# Altium project Solar_Sense_Node.PrjPcb
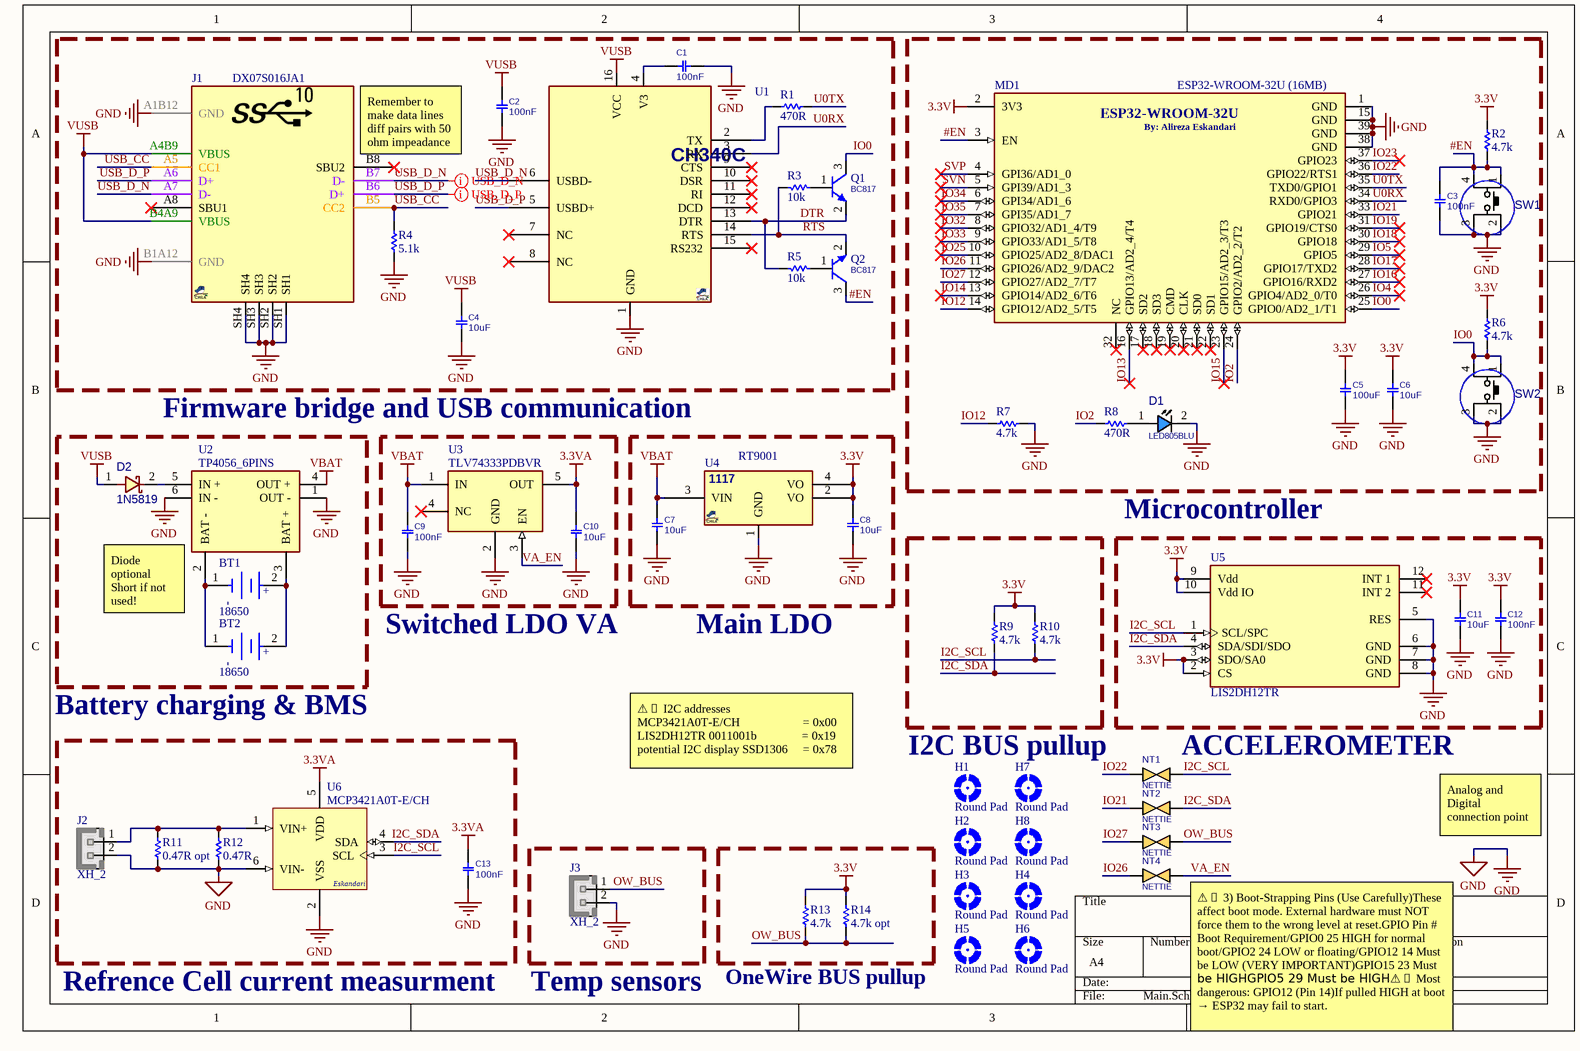
[diagram p0: Main.SchDoc]
1 sheet, 57 parts. Net scope: global (net labels, ports and power ports of the same name join across sheets).
Board file: PCB1.PcbDoc

## Sheet Main.SchDoc: Solar Sesne Node
size A4; CompanyName: University of Tehran; DrawnBy: Alireza Eskandari; SheetNumber: 1; SheetTotal: 1

### Parts
BT1  18650  [FP-1042P-MFG]
BT2  18650  [FP-1042P-MFG]
C1  100nF  [C0805]
C2  100nF  [C0805]
C3  100nF  [C0805]
C4  10uF  [C0805]
C5  100uF  [C0805]
C6  10uF  [C0805]
C7  10uF  [C0805]
C8  10uF  [C0805]
C9  100nF  [C0805]
C10  10uF  [C0805]
C11  10uF  [C0805]
C12  100nF  [C0805]
C13  100nF  [C0805]
D1  LED805BLU  [LED0805BLU]
D2  1N5819  [D_SOD123W]
H1  Round Pad  [P3.0C]  (no BOM)
H2  Round Pad  [P3.0C]  (no BOM)
H3  Round Pad  [P3.0C]  (no BOM)
H4  Round Pad  [P3.0C]  (no BOM)
H5  Round Pad  [P3.0C]  (no BOM)
H6  Round Pad  [P3.0C]  (no BOM)
H7  Round Pad  [P3.0C]  (no BOM)
H8  Round Pad  [P3.0C]  (no BOM)
J1  DX07S016JA1  [USBC_SMD_16_DX07S016JA1]
J2  XH_2  [XH_2]
J3  XH_2  [XH_2]
MD1  ESP32-WROOM-32U (16MB)  [FP-ESP32-WROOM-32U_16MB-MFG]
NT1  NETTIE  [NETTIE_40X50]  (net tie, no BOM)
NT2  NETTIE  [NETTIE_40X50]  (net tie, no BOM)
NT3  NETTIE  [NETTIE_40X50]  (net tie, no BOM)
NT4  NETTIE  [NETTIE_40X50]  (net tie, no BOM)
Q1  BC817  [SOT23_3]
Q2  BC817  [SOT23_3]
R1  470R  [RES0805]
R2  4.7k  [RES0805]
R3  10k  [RES0805]
R4  5.1k  [RES0805]
R5  10k  [RES0805]
R6  4.7k  [RES0805]
R7  4.7k  [RES0805]
R8  470R  [RES0805]
R9  4.7k  [RES0805]
R10  4.7k  [RES0805]
R11  0.47R opt  [RES0805]
R12  0.47R  [RES0805]
R13  4.7k  [RES0805]
R14  4.7k opt  [RES0805]
SW1  PUSHBUTTON  [SWPBS_SPDT_5X5X1]  (value not drawn)
SW2  PUSHBUTTON  [SWPBS_SPDT_5X5X1]  (value not drawn)
U1  CH340C  [SO_16]  (value not drawn)
U2  TP4056_6PINS  [TP4056_6PINs]
U3  TLV74333PDBVR  [FP-DBV0005A-MFG]
U4  RT9001  [SOT223_4]
U5  LIS2DH12TR  [FP-LGA-12-8365767-MFG]
U6  MCP3421A0T-E/CH  [SOT-23-CH6_L]

### Blocks framed on the sheet
Firmware bridge and USB communication: C1 C2 C4 J1 Q1 Q2 R1 R3-R5 U1
Microcontroller: C3 C5 C6 D1 MD1 R2 R6-R8 SW1 SW2
Battery charging & BMS: BT1 BT2 D2 U2
Switched LDO VA: C9 C10 U3
Main LDO: C7 C8 U4
I2C BUS pullup: R9 R10
ACCELEROMETER: C11 C12 U5
Refrence Cell current measurment: C13 J2 R11 R12 U6
Temp sensors: J3
OneWire BUS pullup: R13 R14

### Nets
3.3V: C5.2 C6.2 C8.2 C11.2 C12.1 MD1.2(3V3) R2.2 R6.2 R9.2 R10.2 R13.2 R14.2 U4.2(VO) U4.4(VO) U5.2(CS) U5.3(SDO/SA0) U5.9(Vdd) U5.10(Vdd_IO)
3.3VA: C10.2 C13.2 U3.5(OUT) U6.5(VDD)
GND: C1.1 C2.1 C3.1 C4.1 C5.1 C6.1 C7.1 C8.1 C9.1 C10.1 C11.1 C12.2 C13.1 D1.2(CATHODE) J1.A1B12(GND) J1.B1A12(GND) J1.SH1 J1.SH2 J1.SH3 J1.SH4 J2.2 J3.2 MD1.1(GND) MD1.15(GND) MD1.38(GND) MD1.39(GND) R4.1 R7.1 R11.1 R12.1 SW1.2(P3) SW1.3(P4) SW2.2(P3) SW2.3(P4) U1.1(GND) U2.1(OUT_-) U2.6(IN_-) U3.2(GND) U4.1(GND) U5.5(RES) U5.6(GND) U5.7(GND) U5.8(GND) U6.2(VSS) U6.6(VIN-)
SHIELD: H1.P H2.P H3.P H4.P H5.P H6.P H7.P H8.P
VBAT: C7.2 C9.2 U2.4(OUT_+) U3.1(IN) U4.3(VIN)
VUSB: C2.2 C4.2 D2.1 J1.A4B9(VBUS) J1.B4A9(VBUS) U1.16(VCC)
#EN: C3.2 MD1.3(EN) Q2.3(C) R2.1 SW1.1(P1) SW1.4(P2)
DTR: Q1.2(E) R5.2 U1.13(DTR)
I2C_SCL: NT1.2 R10.1 U5.1(SCL/SPC) U6.3(SCL)
I2C_SDA: NT2.2 R9.1 U5.4(SDA/SDI/SDO) U6.4(SDA)
IO0: MD1.25(GPIO0/AD2_1/T1) Q1.3(C) R6.1 SW2.1(P1) SW2.4(P2)
IO2: MD1.24(GPIO2/AD2_2/T2) R8.2
IO4: MD1.26(GPIO4/AD2_0/T0)
IO5: MD1.29(GPIO5)
IO12: MD1.14(GPIO12/AD2_5/T5) R7.2
IO13: MD1.16(GPIO13/AD2_4/T4)
IO14: MD1.13(GPIO14/AD2_6/T6)
IO15: MD1.23(GPIO15/AD2_3/T3)
IO16: MD1.27(GPIO16/RXD2)
IO17: MD1.28(GPIO17/TXD2)
IO18: MD1.30(GPIO18)
IO19: MD1.31(GPIO19/CTS0)
IO21: MD1.33(GPIO21) NT2.1
IO22: MD1.36(GPIO22/RTS1) NT1.1
IO23: MD1.37(GPIO23)
IO25: MD1.10(GPIO25/AD2_8/DAC1)
IO26: MD1.11(GPIO26/AD2_9/DAC2) NT4.1
IO27: MD1.12(GPIO27/AD2_7/T7) NT3.1
IO32: MD1.8(GPIO32/AD1_4/T9)
IO33: MD1.9(GPIO33/AD1_5/T8)
IO34: MD1.6(GPI34/AD1_6)
IO35: MD1.7(GPI35/AD1_7)
OW_BUS: J3.1 NT3.2 R13.1 R14.1
RTS: Q2.2(E) R3.2 U1.14(RTS)
SVN: MD1.5(GPI39/AD1_3)
SVP: MD1.4(GPI36/AD1_0)
U0RX: MD1.34(RXD0/GPIO3) U1.3(RX)
U0TX: MD1.35(TXD0/GPIO1) R1.1
USB_CC: J1.A5(CC1) J1.B5(CC2) R4.2
USB_D_N: J1.A7(D-) J1.B7(D-) U1.6(USBD-)
USB_D_P: J1.A6(D+) J1.B6(D+) U1.5(USBD+)
VA_EN: NT4.2 U3.3(EN)
NetBT1_1: BT1.1(C) BT2.1(C) U2.2(BAT_-)
NetBT1_2: BT1.2(A) BT2.2(A) U2.3(BAT_+)
NetC1_2: C1.2 U1.4(V3)
NetD1_1: D1.1(ANODE) R8.1
NetD2_2: D2.2 U2.5(IN_+)
NetJ2_1: J2.1 R11.2 R12.2 U6.1(VIN+)
NetQ1_1: Q1.1(B) R3.1
NetQ2_1: Q2.1(B) R5.1
NetR1_2: R1.2 U1.2(TX)

Not connected (* = marked no-connect by the designer): J1 A8(SBU1)* B8(SBU2)*; MD1 17(SD2)* 18(SD3)* 19(CMD)* 20(CLK)* 21(SD0)* 22(SD1)* 32(NC)*; U1 7(NC)* 8(NC)* 9(CTS)* 10(DSR)* 11(RI)* 12(DCD)* 15(RS232)*; U3 4(NC)*; U5 11(INT_2)* 12(INT_1)*

### Layout directives
differential pair: USB_D_N, USB_D_P

### Notes on the sheet
- (near J1) Remember to make data lines diff pairs with 50 ohm impeadance
- (near U2) Diode optional
  Short if not used!
- ⚠️ I2C addresses
  MCP3421A0T-E/CH                     = 0x00
  LIS2DH12TR 0011001b               = 0x19
  potential I2C display SSD1306     = 0x78
- Analog and Digital connection point
- (near NT4) ⚠️ 3) Boot-Strapping Pins (Use Carefully)These affect boot mode. External hardware must NOT force them to the wrong level at reset.GPIO	Pin #	Boot Requirement/GPIO0	25	HIGH for normal boot/GPIO2	24	LOW or floating/GPIO12	14	Must be LOW (VERY IMPORTANT)GPIO15	23	Must be HIGHGPIO5	29	Must be HIGH⚠️ Most dangerous: GPIO12 (Pin 14)If pulled HIGH at boot → ESP32 may fail to start.
- (in symbol BATTERY-HOLDER-18650) +; -
- (in symbol ESP32-WROOM-32U) By: Alireza Eskandari
- (in symbol MCP3421) Eskandari
- (in symbol VREG_1117_SOT223) 1117

### Library data of the parts
BT1 BT2 = BATTERY-HOLDER-18650: BATTERY HOLDER 18650 SMD TAB; Number of Cells: 1; Max Operating Temperature: 145°C; Termination: SMD/SMT; Mount: Surface Mount; Min Operating Temperature: -50°C; Package Quantity: 200; Packaging: Tray; Lead Free: Lead Free
C1-C13 = CAP_SMD_MLCC_0805: CAP, MLCC; PARAM: -, -%; MANF_P#: MANF_PART#; PARAM2: -V; PRICE: 100= 1$; MANF: -; ASSEMBLY: ASSEMBLY
  C1-C3 C9 C12 C13: VALUE: 100nF
  C4 C6-C8 C10 C11: VALUE: 10uF
  C5: VALUE: 100uF
D1 = LED_SMD_0805_BLU: LED, SMD, 0805, BLUE; DESC: DESCRIPTION; MANF_P#: MANF_PART#; PARAM2: 2.2V; MANF: MANF; ASSEMBLY: ASSEMBLY; PRICE: 36t@Javan; VALUE: LED805BLU
D2 = DIODE_SMD_SCHOTTKY_1N5819: DIODE, SCHOTTKY, 40V, 1A; MANF: DIODES; MANF_P#: 1N5819HW-7-F; DESC: DESCRIPTION; ASSEMBLY: ASSEMBLY; PRICE: PRICE; PARAM2: 1A; PARAM: 40V; VALUE: 1N5819
H1-H8 = MOUNT-PAD-ROUND: MOUNTING PAD, round
J1 = CONN_USBC_SMD_16_DX07S016JA1: CONN, USB, Type C, USB 2.0, Right-Angle, SMD; MANF: JAE; MANF_P#: DX07S016JA1R1500; PARAM: 5A; Price: 1.5$; Value: DX07S016JA1
J2 J3 = XH_2: PW10-x-M, JST-BxB-XH-A pitch: 2.5mm, 3A/250v; MANF: JST; MANF_P#: B2B-XH-A; PARAM2: 250v; PARAM: 3.0A; VALUE: XH_2
MD1 = ESP32-WROOM-32U: RX TXRX MODULE WIFI U.FL SMD; Sensitivity: -98dBm; Frequency: 2.5GHz; Memory Size: 536KB; Data Rate: 150Mbps; Interface: I2C; Packaging: Tape and Reel; Case/Package: SMD/SMT; Max Operating Temperature: 85°C; Mount: Surface Mount; Min Operating Temperature: -40°C
NT1-NT4 = NETTIE_40X50: NET TIE; MANF: -; MANF_P#: -; VALUE: NETTIE
Q1 Q2 = NPN_BC817_SOT23: BJT, NPN, 45v, 0.5A, SMD, SOT23; PARAM: 0.5A, Hfe100~600; PARAM2: 45v, 250mW; MANF: NXP, ON; MANF_P#: BC817; VALUE: BC817
R1-R14 = RES SMD PACKAGE: TOTAL SMD RESISTOR PACK; Designer: Alireza Esknadari; ll: RES SMD PAKAGES
SW1 SW2 = SWPBS_SPDT_5X5PTS: SWITCH, PUSH BUTTON, TACTILE, SMD, SPDT, 5X5MM; MANF: CHINA; PARAM: 50mA; DESC: DESCRIPTION; MANF_P#: PTS526SM15SMTR2LFS; PARAM2: 500kCycle; VALUE: PUSHBUTTON; ASSEMBLY: ASSEMBLY; PRICE: -
U1 = CH340C_SOP16: USB-UART; MANF_P#: CH340C; VALUE: CH340C; PACKAGE: SOP-16
U2 = TP4056_6PINS: MODULE BATTERY CHARGER 6 PINS
U3 = TLV74333PDBVR: IC REG LINEAR 3.3V 300MA SOT23-5; Manufacturer: Texas Instruments; Dropout Voltage: 125mV; Output Type: Fixed; Min Supply Voltage: 1.4V; Max Supply Voltage: 5.5V; Output Voltage: 1-3.3V; Standoff Height: 0mm; Nominal Supply Current: 34uA; Number Of Outputs: 1; Accuracy Percentage: 1%; Max Junction Temp: +125°C; Mouser Description: 300mA Low-Dropout (LDO) Regulator 5-SOT-23 -40 to 125; Device Class L1: Integrated Circuits (ICs); Temperature Range High: +125°C; Octopart: https://octopart.com/tlv74333pdbvr-texas+instruments-84791760; Device Class L3: Voltage Regulators - Linear; Height: 1.45mm; Category: IC; Temperature Range Low: -40°C; Output Current: 300mA; RoHS: TRUE; Automotive: No; Manufacturer Part Number: TLV74333PDBVR; Digikey Description: IC REG LINEAR 3.3V 300MA SOT23-5; Package: DBV0005A; Temperature: -40°C to +125°C; ComponentLink2URL: http://www.ti.com/lit/ds/symlink/tlv743p.pdf; Lead Free: Yes; Device Class L2: Power Management ICs; ComponentLink2Description: Datasheet
U4 = VREG_1117_SOT223: REG, Linear, LDO1V, 0.6A, SOT-223; MANF: TI, ON, ST; PARAM2: 3.3V; MANF_P#: RT9001; PARAM: LDO1V, 0.6A; VALUE: RT9001
U5 = LIS2DH12TR: ACCEL 2-16G I2C/SPI 12LGA; Output Type: SPI; Axis: X, Y, Z; Interface: I2C; Max Supply Voltage: 3.6V; Bandwidth: 672Hz; Min Supply Voltage: 1.71V; Min Operating Temperature: -40°C; Width: 2.15mm; Lead Free: Lead Free; Case/Package: LGA; Contact Plating: Gold; Number of Pins: 12; Max Operating Temperature: 85°C; Packaging: Cut Tape; Radiation Hardening: No; Length: 2.15mm; REACH SVHC: No SVHC; Height: 1mm; Mount: Surface Mount
U6 = MCP3421: 18-Bit Analog-to-Digital Converter with I2C Interface and On-Board Reference, 6-Pin SOT-23, Extended Temperature, Tape and Reel; ComponentLink1URL: http://www.microchip.com/; ComponentLink2URL: http://ww1.microchip.com/downloads/en/DeviceDoc/22003e.pdf; ComponentLink1Description: Manufacturer URL; ComponentLink2Description: Datasheet; PackageVersion: revBB, Aug-2009; ComponentLink3URL: http://www.microchip.com/stellent/groups/techpub_sg/documents/packagingspec/en012702.pdf; RevisionNote: URLs added.; DatasheetVersion: revE, Aug-2009; PackageReference: SOT-23-CH6; Code_IPC: SOT26A-6; PackageDescription: 6-Lead Plastic Small Outline Transistor (CH) [SOT-23]; ComponentLink3Description: Package Specification